# Altium schematic sheet 02_FPGA_CORE.SchDoc
size A; SheetNumber: 4; SheetTotal: 5
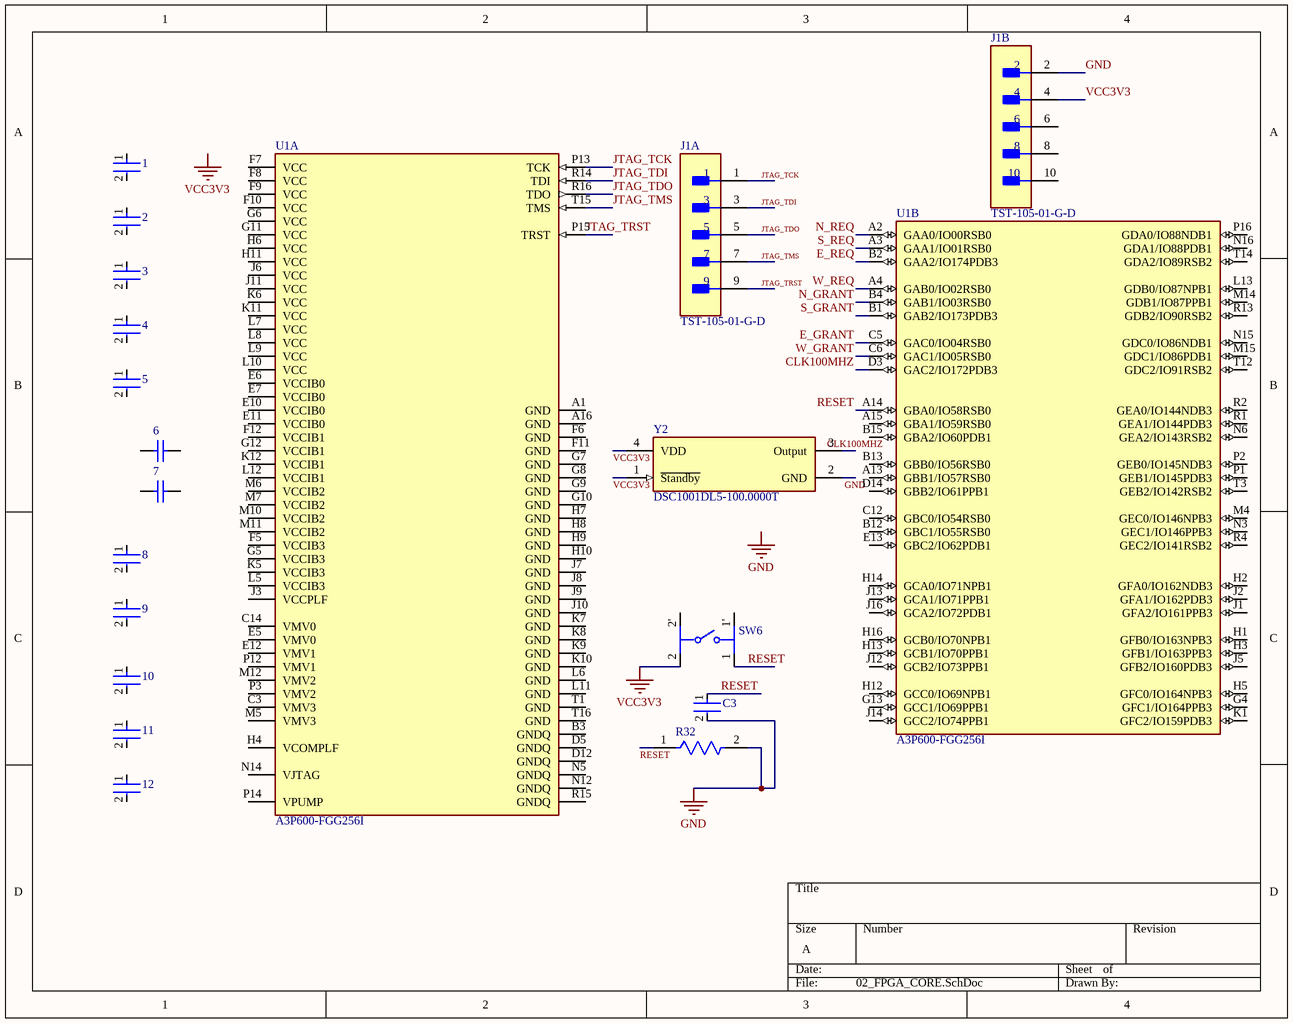
[diagram p0: 02_FPGA_CORE.SchDoc]

## Parts
1  (no value)  [FP-MC0603-IPC_B]
2  (no value)  [FP-MC0603-IPC_B]
3  (no value)  [FP-MC0603-IPC_B]
4  (no value)  [FP-MC0603-IPC_B]
5  (no value)  [FP-MC0603-IPC_B]
6  (no value)  [CAPC2013X145X50ML20T25]
7  (no value)  [CAPC2013X145X50ML20T25]
8  (no value)  [FP-MC0603-IPC_B]
9  (no value)  [FP-MC0603-IPC_B]
10  (no value)  [FP-MC0603-IPC_B]
11  (no value)  [FP-MC0603-IPC_B]
12  (no value)  [FP-MC0603-IPC_B]
C3  (no value)  [FP-MC0603-IPC_B]
J1  TST-105-01-G-D  [FP-TST-105-01-G-D-MFG]  (parts A,B of 2)
R32  (no value)  [FP-RT0603-IPC_C]
SW6  (no value)  [FP-EVQ-P7A01P-MFG]
U1  A3P600-FGG256I  [FP-FG256-IPC_C]  (parts A,B of 4)
Y2  DSC1001DL5-100.0000T  [FP-CDFN2520-4LD-PL-1-MFG]

## Nets
GND: C3.2 J1.2 R32.2 Y2.2(GND)
VCC3V3: J1.4 SW6.2 Y2.1(~{Standby}) Y2.4(VDD)
CLK100MHZ: U1.D3(GAC2/IO172PDB3) Y2.3(Output)
E_GRANT: U1.C5(GAC0/IO04RSB0)
E_REQ: U1.B2(GAA2/IO174PDB3)
JTAG_TCK: J1.1 U1.P13(TCK)
JTAG_TDI: J1.3 U1.R14(TDI)
JTAG_TDO: J1.5 U1.R16(TDO)
JTAG_TMS: J1.7 U1.T15(TMS)
JTAG_TRST: J1.9 U1.P15(TRST)
N_GRANT: U1.B4(GAB1/IO03RSB0)
N_REQ: U1.A2(GAA0/IO00RSB0)
RESET: C3.1 R32.1 SW6.1 U1.A14(GBA0/IO58RSB0)
S_GRANT: U1.B1(GAB2/IO173PDB3)
S_REQ: U1.A3(GAA1/IO01RSB0)
W_GRANT: U1.C6(GAC1/IO05RSB0)
W_REQ: U1.A4(GAB0/IO02RSB0)

Not connected (* = marked no-connect by the designer): 1 1 2; 2 1 2; 3 1 2; 4 1 2; 5 1 2; 6 1 2; 7 1 2; 8 1 2; 9 1 2; 10 1 2; 11 1 2; 12 1 2; J1 6 8 10; SW6 1' 2'; U1 A1(GND) A13(GBB1/IO57RSB0) A15(GBA1/IO59RSB0) A16(GND) B3(GNDQ) B12(GBC1/IO55RSB0) B13(GBB0/IO56RSB0) B15(GBA2/IO60PDB1) C3(VMV3) C12(GBC0/IO54RSB0) C14(VMV0) D5(GNDQ) D12(GNDQ) D14(GBB2/IO61PPB1) E5(VMV0) E6(VCCIB0) E7(VCCIB0) E10(VCCIB0) E11(VCCIB0) E12(VMV1) E13(GBC2/IO62PDB1) F5(VCCIB3) F6(GND) F7(VCC) F8(VCC) F9(VCC) F10(VCC) F11(GND) F12(VCCIB1) G4(GFC1/IO164PPB3) G5(VCCIB3) G6(VCC) G7(GND) G8(GND) G9(GND) G10(GND) G11(VCC) G12(VCCIB1) G13(GCC1/IO69PPB1) H1(GFB0/IO163NPB3) H2(GFA0/IO162NDB3) H3(GFB1/IO163PPB3) H4(VCOMPLF) H5(GFC0/IO164NPB3) H6(VCC) H7(GND) H8(GND) H9(GND) H10(GND) H11(VCC) H12(GCC0/IO69NPB1) H13(GCB1/IO70PPB1) H14(GCA0/IO71NPB1) H16(GCB0/IO70NPB1) J1(GFA2/IO161PPB3) J2(GFA1/IO162PDB3) J3(VCCPLF) J5(GFB2/IO160PDB3) J6(VCC) J7(GND) J8(GND) J9(GND) J10(GND) J11(VCC) J12(GCB2/IO73PPB1) J13(GCA1/IO71PPB1) J14(GCC2/IO74PPB1) J16(GCA2/IO72PDB1) K1(GFC2/IO159PDB3) K5(VCCIB3) K6(VCC) K7(GND) K8(GND) K9(GND) K10(GND) K11(VCC) K12(VCCIB1) L5(VCCIB3) L6(GND) L7(VCC) L8(VCC) L9(VCC) L10(VCC) L11(GND) L12(VCCIB1) L13(GDB0/IO87NPB1) M4(GEC0/IO146NPB3) M5(VMV3) M6(VCCIB2) M7(VCCIB2) M10(VCCIB2) M11(VCCIB2) M12(VMV2) M14(GDB1/IO87PPB1) M15(GDC1/IO86PDB1) N3(GEC1/IO146PPB3) N5(GNDQ) N6(GEA2/IO143RSB2) N12(GNDQ) N14(VJTAG) N15(GDC0/IO86NDB1) N16(GDA1/IO88PDB1) P1(GEB1/IO145PDB3) P2(GEB0/IO145NDB3) P3(VMV2) P12(VMV1) P14(VPUMP) P16(GDA0/IO88NDB1) R1(GEA1/IO144PDB3) R2(GEA0/IO144NDB3) R4(GEC2/IO141RSB2) R13(GDB2/IO90RSB2) R15(GNDQ) T1(GND) T3(GEB2/IO142RSB2) T12(GDC2/IO91RSB2) T14(GDA2/IO89RSB2) T16(GND)

## Notes on the sheet
- Labels drawn without touching a wire or pin: GND, VCC3V3

## Library data of the parts
1-5 8-12 C3 = CMP-12266-000001-1: Ceramic Capacitor, Multilayer, Ceramic, 50V, 10% +Tol, 10% -Tol, X7R, -/+15ppm/Cel TC, 0.1uF, 0603; Capacitance: 100nF; Case Code (Imperial): 0603; Dielectric: X7R; Max Operating Temperature: 125°C; Packaging: Cut Tape; Min Operating Temperature: -55°C; Voltage Rating (DC): 50V; Tolerance: 10%; RoHS Compliant: Yes; Number of Pins: 2; Case/Package: 0603; Voltage Rating: 50V; Case Code (Metric): 1608
6 7 = CMP-2007-01044-1: Manufacturer: Kemet; Part Number: C0805C106K8RACTU
J1 = CMP-02766-001680-1: CONN HEADER VERT 10POS 2.54MM; Connector Type: Male Pin; Number of Contacts: 10; Max Current Rating: 3A; Gender: Male; Row Spacing: 0.1inch; Contact Material: Bronze; Contact Type: Male Pin; Housing Color: Black; Depth: 9.27mm; Number of Positions: 10; REACH SVHC: No SVHC; Max Operating Temperature: 125°C; RoHS Compliant: Yes; Housing Material: Polyester; Series: Flex Stack, TST; Contact Plating: Gold; Mount: Through Hole; Min Operating Temperature: -55°C; Color: Black; Contact Mating Length: 0.25inch; Pitch: 2.54mm; Radiation Hardening: No; Packaging: Rail/Tube; Length: 20.32mm; Orientation: Straight; Number of Rows: 2; Termination: Solder
R32 = CMP-03412-024743-1: RES SMD 10K OHM 0.05% 1/10W 0603; Manufacturer: Yageo; Manufacturer Part Number: RT0603WRE0710KL; Power Rating: 0.1W; Value: 10KΩ; Voltage Rating: 75V; Tolerance: 0.0005; Temperature Coefficient: 50 ppm/°C; Height: 0.55mm; ComponentLink2URL: http://www.yageo.com/documents/recent/PYu-RT_1-to-0.01_RoHS_L_9.pdf; Mouser Description: Res SMD 10K Ohm 0.05% 1/10W 0603; Device Class L1: Passive Components; Octopart: https://octopart.com/rt0603wre0710kl-yageo-71396825; Lead Free: Yes; RoHS: TRUE; ComponentLink2Description: Datasheet; Package: RT0603; Ipc Land Pattern Name: RESC16080X45; Automotive: No; Temperature: -55°C to +155°C; Series: RT; Resistance: 10KΩ; Footprint Url: http://www.yageo.com/exep/pages/download/literatures/PYu-R_Mount_10.pdf; Temperature Range Low: -55°C; Digikey Description: RES SMD 10K OHM 0.05% 1/10W 0603; Category: Res; Device Class L3: Chip SMD Resistors; Temperature Range High: +155°C; Device Class L2: Resistors; Composition: Thin Film
SW6 = CMP-05618-000007-1: SWITCH TACTILE SPST-NO 0.05A 12V; Manufacturer: Panasonic; Manufacturer Part Number: EVQ-P7A01P; Operating Force: 2.2N; Contact Resistance: 500mΩ; Contact Current Rating: 50mA; Electromechanical Life: 100000Cycles; Device Class L2: Switches; Lead Free: Yes; Mount: Surface Mount; Digikey Description: SWITCH TACTILE SPST-NO 0.05A 12V; Temperature Range High: +70°C; Device Class L3: Tactile Switches; Package: EVQ-P7A01P; Voltage Rating Dc: 12V; Octopart: https://octopart.com/evq-p7a01p-panasonic-29917075; ComponentLink2URL: https://industrial.panasonic.com/cdbs/www-data/pdf/ATK0000/ATK0000C378.pdf; Automotive: No; Device Class L1: Electromechanical; Mouser Description: SWITCH TACTILE SPST-NO 0.05A 12V; Temperature: -20°C to +70°C; ComponentLink2Description: Datasheet; RoHS: TRUE; Category: Switch; Temperature Range Low: -20°C; Throw Configuration: SPST-NO; Height: 1.55mm
U1 = CMP-00252-99164184-1: A3P600-FGG256I FPGA ProASIC®3 Family 600K Gates 231MHz 130nm (CMOS) Technology 1.5V 256-Pin FBGA; Number of Logic Elements/Cells: 6500; Min Supply Voltage: 1.4V; Memory Size: 13.5kB; Max Supply Voltage: 1.575V; Number of I/Os: 177; Max Junction Temperature (Tj): 100°C; Memory Type: RAM; Number of Gates: 600000; Operating Supply Current: 45mA; Number of Logic Blocks (LABs): 24; Nominal Supply Current: 5mA; Number of Registers: 13824; Number of Pins: 256; Max Operating Temperature: 85°C; Length: 17mm; Height: 1.2mm; Max Frequency: 231MHz; Operating Supply Voltage: 1.5V; Mount: Surface Mount; Min Operating Temperature: -40°C; Radiation Hardening: No; RAM Size: 13.5kB; Frequency: 231MHz; Case/Package: FBGA; Lead Free: Lead Free; Lifecycle Status: Production; Width: 17mm; NexarPartId: 99164184; RoHS: Compliant
Y2 = CMP-00252-66799144-1: DSC1001DL5-100.0000T Oscillator MEMS 100MHz ±10ppm (Stability) 15pF CMOS 55% 1.8V/2.5V/3.3V Automotive 4-Pin CDFN SMD T/R; Operating Supply Voltage: 3.3V; Min Supply Voltage: 1.7V; Max Supply Voltage: 3.6V; Max Supply Current: 8.7mA; Length: 2.4892mm; Frequency Stability: 10ppm; Width: 2.0066mm; Frequency: 100MHz; Termination: Solder; Max Duty Cycle: 55%; Height: 889µm; Case/Package: SMD/SMT; Lifecycle Status: Production; Schedule B: 8542390000, 8542390000|8542390000|8542390000|8542390000|8542390000|8542390000|8542390000|8542390000|8542390000|8542390000|8542390000|8542390000|8542390000|8542390000|8542390000|8542390000|8542390000|8542390000|8542390000|8542390000|8542390000|8542390000|8542390000|85; Max Operating Temperature: 105°C; Mount: Standard, Surface Mount; RoHS: Compliant; Ratings: AEC-Q100; Load Capacitance: 15pF; NexarPartId: 66799144; Min Operating Temperature: -40°C